# EAGLE design HumidityMetter (EAGLE 6.1)
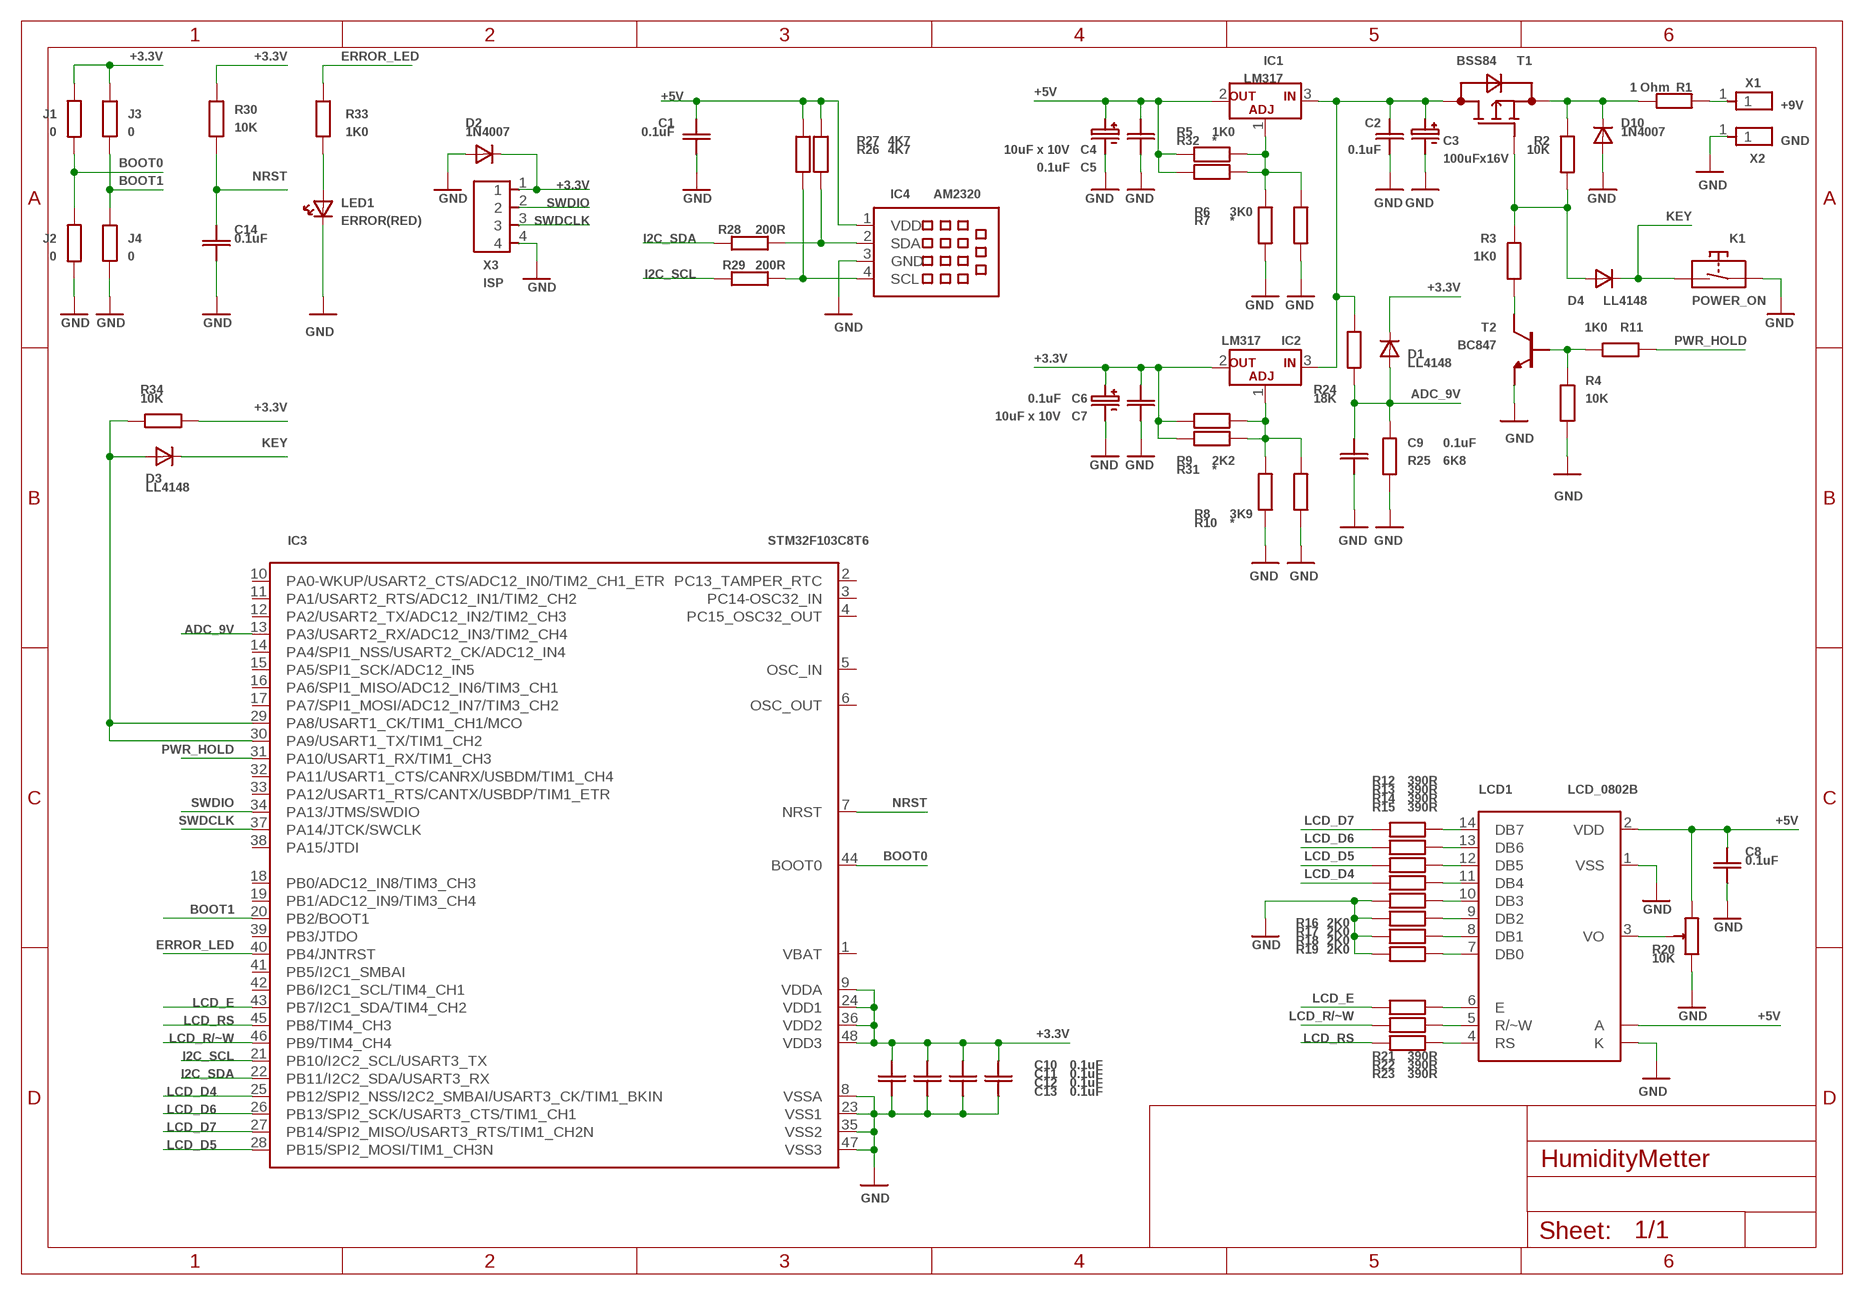
[diagram p0: schematic, sheet 1]

## Parts
C1  0.1uF  CSMD_0805  [RSMD_0805]
C2  0.1uF  CSMD_0805  [RSMD_0805]
C3  100uFx16V  CE6.3MM  [CE_6.3MM]
C4  10uF x 10V  CE5.2MM  [CE_5.2MM]
C5  0.1uF  CSMD_0805  [RSMD_0805]
C6  0.1uF  CSMD_0805  [RSMD_0805]
C7  10uF x 10V  CE5.2MM  [CE_5.2MM]
C8  0.1uF  CSMD_0805  [RSMD_0805]
C9  0.1uF  CSMD_0805  [RSMD_0805]
C10  0.1uF  CSMD_0805  [RSMD_0805]
C11  0.1uF  CSMD_0805  [RSMD_0805]
C12  0.1uF  CSMD_0805  [RSMD_0805]
C13  0.1uF  CSMD_0805  [RSMD_0805]
C14  0.1uF  CSMD_0805  [RSMD_0805]
D1  LL4148  LL4147SOD-80  [SOD-80]
D2  1N4007  1N4001DO-41_10MM  [DO-41_10MM]
D3  LL4148  LL4147SOD-80  [SOD-80]
D4  LL4148  LL4147SOD-80  [SOD-80]
D10  1N4007  1N4001DO-41_10MM  [DO-41_10MM]
IC1  LM317  LM317(D2PAK)  [D2PAK]
IC2  LM317  LM317(D2PAK)  [D2PAK]
IC3  STM32F103C8T6  STM32F103C8T6(LQFP48)(LQFP48)  [LQFP48]
IC4  AM2320  AM2320(HOR)  [AM2320_HOR]
J1  0  RSMD_0805  [RSMD_0805]
J2  0  RSMD_0805  [RSMD_0805]
J3  0  RSMD_0805  [RSMD_0805]
J4  0  RSMD_0805  [RSMD_0805]
K1  POWER_ON  KEY(7X4.5)  [KEY_7X4.5]
LCD1  LCD_0802B  LCD_0802B(0802B_CHINA_CLONE)  [LCD_0802B(CHINA_CLONE)]
LED1  ERROR(RED)  LED3MM(SMD0805)  [LED_0805]
R1  1 Ohm  R0207  [R0207]
R2  10K  RSMD_0805  [RSMD_0805]
R3  1K0  RSMD_0805  [RSMD_0805]
R4  10K  RSMD_0805  [RSMD_0805]
R5  1K0  RSMD_0805  [RSMD_0805]
R6  3K0  RSMD_0805  [RSMD_0805]
R7  *  RSMD_0805  [RSMD_0805]
R8  3K9  RSMD_0805  [RSMD_0805]
R9  2K2  RSMD_0805  [RSMD_0805]
R10  *  RSMD_0805  [RSMD_0805]
R11  1K0  RSMD_1206_BIG_GAP  [RSMD_1206_BIG_GAP]
R12  390R  RSMD_0805  [RSMD_0805]
R13  390R  RSMD_0805  [RSMD_0805]
R14  390R  RSMD_0805  [RSMD_0805]
R15  390R  RSMD_0805  [RSMD_0805]
R16  2K0  RSMD_0805  [RSMD_0805]
R17  2K0  RSMD_0805  [RSMD_0805]
R18  2K0  RSMD_0805  [RSMD_0805]
R19  2K0  RSMD_0805  [RSMD_0805]
R20  10K  R_ADJSTAND_6.5_X_3.5MM  [R_ADJ_STAND]
R21  390R  RSMD_0805  [RSMD_0805]
R22  390R  RSMD_0805  [RSMD_0805]
R23  390R  RSMD_0805  [RSMD_0805]
R24  18K  RSMD_1206_BIG_GAP  [RSMD_1206_BIG_GAP]
R25  6K8  RSMD_0805  [RSMD_0805]
R26  4K7  R0207  [R0207]
R27  4K7  R0207  [R0207]
R28  200R  R0207  [R0207]
R29  200R  R0207  [R0207]
R30  10K  RSMD_0805  [RSMD_0805]
R31  *  RSMD_0805  [RSMD_0805]
R32  *  RSMD_0805  [RSMD_0805]
R33  1K0  RSMD_0805  [RSMD_0805]
R34  10K  RSMD_0805  [RSMD_0805]
T1  BSS84  BSS84(SOT23)  [SOT23]
T2  BC847  BC847SOT23_SMALL_PADS  [SOT23_SMALL_PADS]
X1  +9V  PIN1X13.5MM_DRILL  [PIN1X1_D3.5MM]
X2  GND  PIN1X13.5MM_DRILL  [PIN1X1_D3.5MM]
X3  ISP  PIN4X1(2.54MM)  [PIN4X1_2.54MM]

## Nets
+3.3V: C6.PAD_1(PIN1) C7.PLUS C10.PAD_1(PIN1) C11.PAD_1(PIN1) C12.PAD_1(PIN1) C13.PAD_1(PIN1) D1.CATHODE D2.CATHODE IC2.2(OUT) IC3.9(VDDA) IC3.24(VDD1) IC3.36(VDD2) IC3.48(VDD3) J1.PAD_0(PIN0) J3.PAD_0(PIN0) R9.PAD_1(PIN1) R30.PAD_0(PIN0) R31.PAD_1(PIN1) R34.PAD_1(PIN1) X3.1
+5V: C1.PAD_1(PIN1) C4.PLUS C5.PAD_1(PIN1) C8.PAD_1(PIN1) IC1.2(OUT) IC4.1(VDD) LCD1.2(VDD) LCD1.A R5.PAD_1(PIN1) R20.3(END_B) R26.PAD_0(PIN0) R27.PAD_0(PIN0) R32.PAD_1(PIN1)
ADC_9V: C9.PAD_1(PIN1) D1.ANODE IC3.13(PA3/USART2_RX/ADC12_IN3/TIM2_CH4) R24.PAD_1(PIN1) R25.PAD_0(PIN0)
BOOT0: IC3.44(BOOT0) J1.PAD_1(PIN1) J2.PAD_0(PIN0)
BOOT1: IC3.20(PB2/BOOT1) J3.PAD_1(PIN1) J4.PAD_0(PIN0)
ERROR_LED: IC3.40(PB4/JNTRST) R33.PAD_0(PIN0)
GND: C1.PAD_0(PIN0) C2.PAD_0(PIN0) C3.MINUS C4.MINUS C5.PAD_0(PIN0) C6.PAD_0(PIN0) C7.MINUS C8.PAD_0(PIN0) C9.PAD_0(PIN0) C10.PAD_0(PIN0) C11.PAD_0(PIN0) C12.PAD_0(PIN0) C13.PAD_0(PIN0) C14.PAD_0(PIN0) D2.ANODE D10.ANODE IC3.8(VSSA) IC3.23(VSS1) IC3.35(VSS2) IC3.47(VSS3) IC4.3(GND) J2.PAD_1(PIN1) J4.PAD_1(PIN1) K1.1 K1.2 LCD1.1(VSS) LCD1.K LED1.CATHODE R4.PAD_1(PIN1) R6.PAD_1(PIN1) R7.PAD_1(PIN1) R8.PAD_1(PIN1) R10.PAD_1(PIN1) R16.PAD_1(PIN1) R17.PAD_1(PIN1) R18.PAD_1(PIN1) R19.PAD_1(PIN1) R20.1(END_A) R25.PAD_1(PIN1) T2.2(E) X2.1 X3.4
I2C_SCL: IC3.21(PB10/I2C2_SCL/USART3_TX) R29.PAD_0(PIN0)
I2C_SDA: IC3.22(PB11/I2C2_SDA/USART3_RX) R28.PAD_0(PIN0)
KEY: D3.CATHODE D4.CATHODE K1.3 K1.4
LCD_D4: IC3.25(PB12/SPI2_NSS/I2C2_SMBAI/USART3_CK/TIM1_BKIN) R15.PAD_1(PIN1)
LCD_D5: IC3.28(PB15/SPI2_MOSI/TIM1_CH3N) R14.PAD_1(PIN1)
LCD_D6: IC3.26(PB13/SPI2_SCK/USART3_CTS/TIM1_CH1) R13.PAD_1(PIN1)
LCD_D7: IC3.27(PB14/SPI2_MISO/USART3_RTS/TIM1_CH2N) R12.PAD_1(PIN1)
LCD_E: IC3.43(PB7/I2C1_SDA/TIM4_CH2) R21.PAD_1(PIN1)
LCD_R/~W: IC3.46(PB9/TIM4_CH4) R22.PAD_1(PIN1)
LCD_RS: IC3.45(PB8/TIM4_CH3) R23.PAD_1(PIN1)
N$1: R1.PAD1(PIN1) X1.1
N$2: D10.CATHODE R1.PAD_0(PIN0) R2.PAD_0(PIN0) T1.2(SOURCE)
N$3: D4.ANODE R2.PAD_1(PIN1) R3.PAD_0(PIN0) T1.1(GATE)
N$4: R3.PAD_1(PIN1) T2.3(C)
N$5: R4.PAD_0(PIN0) R11.PAD_1(PIN1) T2.1(B)
N$6: C2.PAD_1(PIN1) C3.PLUS IC1.3(IN) IC2.3(IN) R24.PAD_0(PIN0) T1.3(DRAIN)
N$7: IC1.1(ADJ) R5.PAD_0(PIN0) R6.PAD_0(PIN0) R7.PAD_0(PIN0) R32.PAD_0(PIN0)
N$8: IC2.1(ADJ) R8.PAD_0(PIN0) R9.PAD_0(PIN0) R10.PAD_0(PIN0) R31.PAD_0(PIN0)
N$9: LCD1.3(VO) R20.2(ADJ)
N$10: LCD1.14(DB7) R12.PAD_0(PIN0)
N$11: LCD1.13(DB6) R13.PAD_0(PIN0)
N$12: LCD1.12(DB5) R14.PAD_0(PIN0)
N$13: LCD1.11(DB4) R15.PAD_0(PIN0)
N$14: IC4.2(SDA) R26.PAD1(PIN1) R28.PAD1(PIN1)
N$15: LCD1.10(DB3) R16.PAD_0(PIN0)
N$16: LCD1.9(DB2) R17.PAD_0(PIN0)
N$17: LCD1.8(DB1) R18.PAD_0(PIN0)
N$18: LCD1.7(DB0) R19.PAD_0(PIN0)
N$19: LED1.ANODE R33.PAD_1(PIN1)
N$20: IC4.4(SCL) R27.PAD1(PIN1) R29.PAD1(PIN1)
N$21: LCD1.4(RS) R23.PAD_0(PIN0)
N$22: LCD1.5(R/~W) R22.PAD_0(PIN0)
N$23: LCD1.6(E) R21.PAD_0(PIN0)
N$24: D3.ANODE IC3.29(PA8/USART1_CK/TIM1_CH1/MCO) IC3.30(PA9/USART1_TX/TIM1_CH2) R34.PAD_0(PIN0)
NRST: C14.PAD_1(PIN1) IC3.7(NRST) R30.PAD_1(PIN1)
PWR_HOLD: IC3.31(PA10/USART1_RX/TIM1_CH3) R11.PAD_0(PIN0)
SWDCLK: IC3.37(PA14/JTCK/SWCLK) X3.3
SWDIO: IC3.34(PA13/JTMS/SWDIO) X3.2
Unconnected: IC3.1(VBAT) IC3.2(PC13_TAMPER_RTC) IC3.3(PC14-OSC32_IN) IC3.4(PC15_OSC32_OUT) IC3.5(OSC_IN) IC3.6(OSC_OUT) IC3.10(PA0-WKUP/USART2_CTS/ADC12_IN0/TIM2_CH1_ETR) IC3.11(PA1/USART2_RTS/ADC12_IN1/TIM2_CH2) IC3.12(PA2/USART2_TX/ADC12_IN2/TIM2_CH3) IC3.14(PA4/SPI1_NSS/USART2_CK/ADC12_IN4) IC3.15(PA5/SPI1_SCK/ADC12_IN5) IC3.16(PA6/SPI1_MISO/ADC12_IN6/TIM3_CH1) IC3.17(PA7/SPI1_MOSI/ADC12_IN7/TIM3_CH2) IC3.18(PB0/ADC12_IN8/TIM3_CH3) IC3.19(PB1/ADC12_IN9/TIM3_CH4) IC3.32(PA11/USART1_CTS/CANRX/USBDM/TIM1_CH4) IC3.33(PA12/USART1_RTS/CANTX/USBDP/TIM1_ETR) IC3.38(PA15/JTDI) IC3.39(PB3/JTDO) IC3.41(PB5/I2C1_SMBAI) IC3.42(PB6/I2C1_SCL/TIM4_CH1)

## Library data of the parts
C1 C2 C5 C6 C8-C14 = __MyCommonLib1:C
C3 C4 C7 = __MyCommonLib1:CE
D1 D3 D4 = __MyCommonLib1:LL4147
D2 D10 = __MyCommonLib1:1N4001
IC1 IC2 = __MyCommonLib1:LM317
IC3 = __MyCommonLib1:STM32F103C8T6(LQFP48)
IC4 = __MyCommonLib1:AM2320
J1-J4 R1-R19 R21-R34 = __MyCommonLib1:R
K1 = __MyCommonLib1:KEY
LCD1 = __MyCommonLib1:LCD_0802B
LED1 = __MyCommonLib1:LED3MM
R20 = __MyCommonLib1:R_ADJ
T1 = __MyCommonLib1:BSS84
T2 = __MyCommonLib1:BC847
X1 X2 = __MyCommonLib1:PIN1X1
X3 = __MyCommonLib1:PIN4X1

## Board
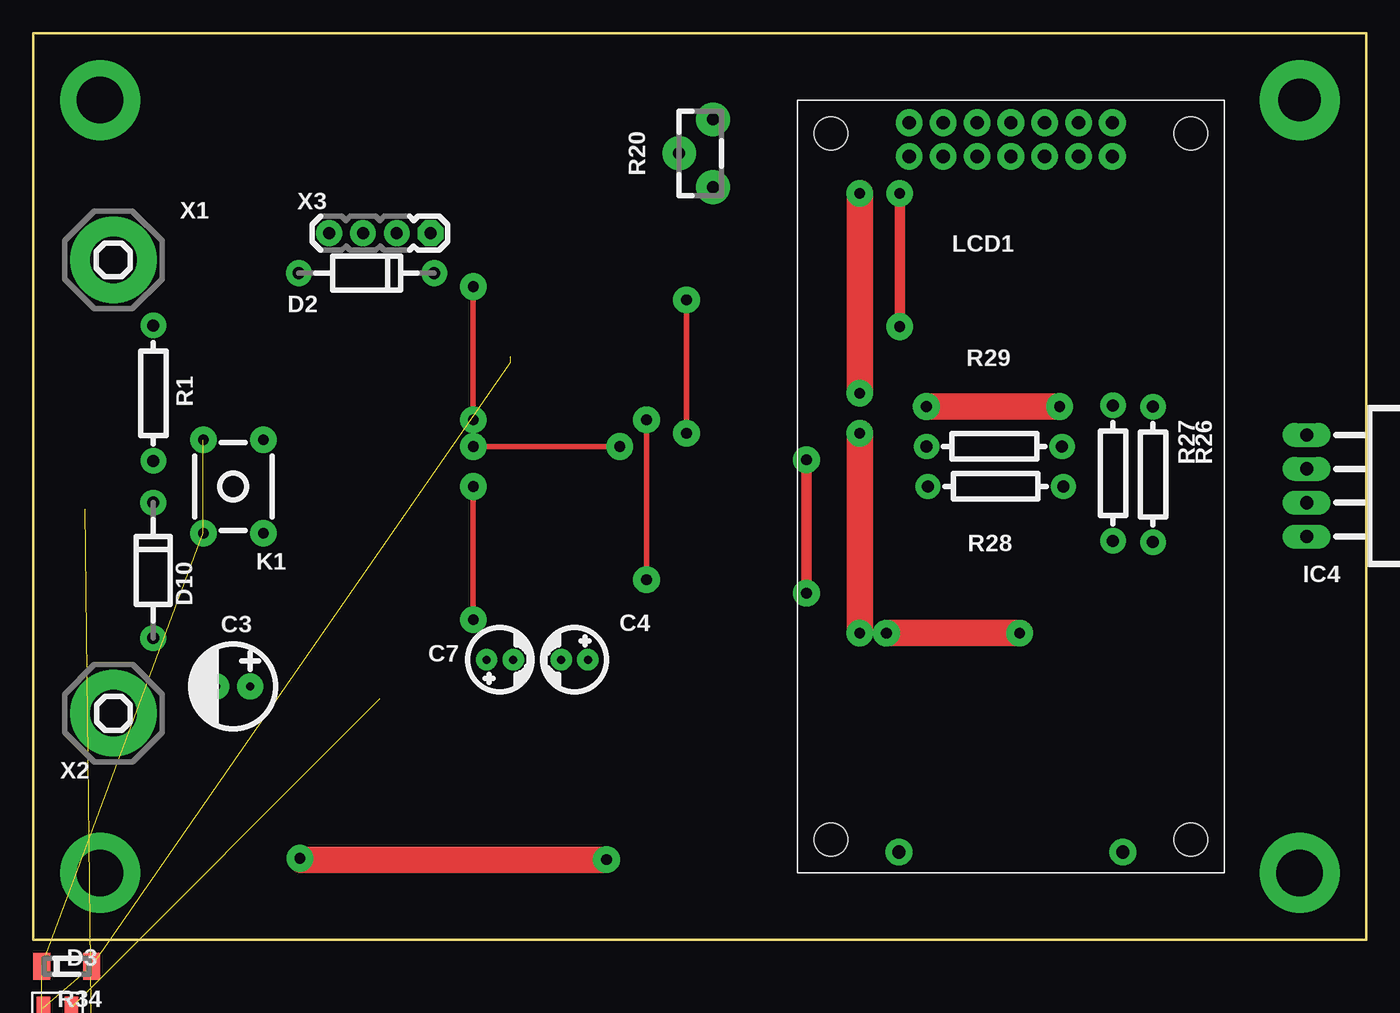
[diagram p1: board, top side]
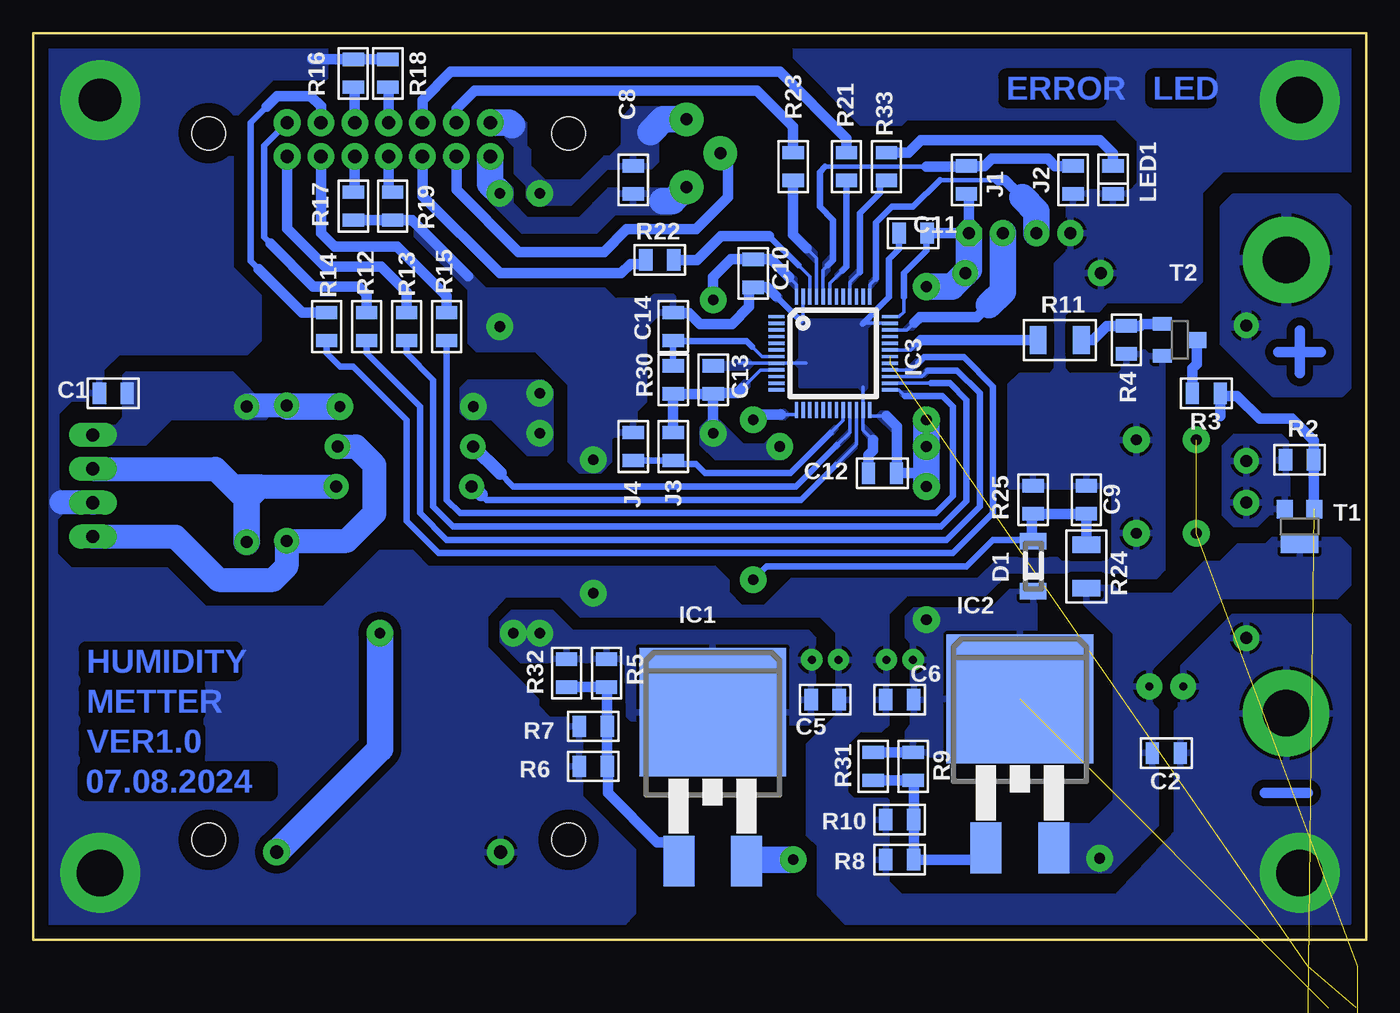
[diagram p2: board, bottom side, seen from below]

Size 100 x 68 mm. Coordinates in mm from the lower left corner, seen from the top.
Outline: 0,0 100,0 100,68 0,68 0,0
Copper layers (1*16): Top 0.035mm / dielectric 1.5mm / Bottom 0.035mm
Design rules: minimum track width 0.25mm, minimum drill 0.6mm, track to track 0.25mm, track to pad 0.25mm, pad to pad 0.25mm, via to via 0.25mm, smd to smd 0mil, copper to edge 1mm, drill to drill 0.5mm, minimum pad ring 10mil, minimum via ring 8mil, stop-mask expansion 4mil, vias tented up to drill 0mil, thermal gap 10mil

### Footprints (pad centres in the part's own frame; a part is rotated, then mirrored left to right if it is on the bottom)
RSMD_0805 = smd 1 x 1.6: PAD_0 -1.05,0; PAD_1 1.05,0
CE_6.3MM = drill 0.6 pad 1.93: MINUS -1.27,0; PLUS 1.27,0
CE_5.2MM = drill 0.6 pad 1.6: MINUS -1,0; PLUS 1,0
SOD-80 = smd 1.25 x 2: ANODE 1.875,0; CATHODE -1.875,0
DO-41_10MM = drill 0.9 pad 1.93: ANODE -5.08,0; CATHODE 5.08,0
D2PAK = smd 2.32 x 3.81: 1 -2.54,-11.17; 3 2.54,-11.17 | smd 11 x 9.65: 2 0,0
LQFP48 = smd 0.25 x 1.2: 1 -2.75,-4.25; 2 -2.25,-4.25; 3 -1.75,-4.25; 4 -1.25,-4.25; 5 -0.75,-4.25; 6 -0.25,-4.25; 7 0.25,-4.25; 8 0.75,-4.25; 9 1.25,-4.25; 10 1.75,-4.25; 11 2.25,-4.25; 12 2.75,-4.25; 25 2.75,4.25; 26 2.25,4.25; 27 1.75,4.25; 28 1.25,4.25; 29 0.75,4.25; 30 0.25,4.25; 31 -0.25,4.25; 32 -0.75,4.25; 33 -1.25,4.25; 34 -1.75,4.25; 35 -2.25,4.25; 36 -2.75,4.25 | smd 1.2 x 0.25: 13 4.25,-2.75; 14 4.25,-2.25; 15 4.25,-1.75; 16 4.25,-1.25; 17 4.25,-0.75; 18 4.25,-0.25; 19 4.25,0.25; 20 4.25,0.75; 21 4.25,1.25; 22 4.25,1.75; 23 4.25,2.25; 24 4.25,2.75; 37 -4.25,2.75; 38 -4.25,2.25; 39 -4.25,1.75; 40 -4.25,1.25; 41 -4.25,0.75; 42 -4.25,0.25; 43 -4.25,-0.25; 44 -4.25,-0.75; 45 -4.25,-1.25; 46 -4.25,-1.75; 47 -4.25,-2.25; 48 -4.25,-2.75
AM2320_HOR = drill 1 pad 1.8 long: 1 -4.5,3.81; 2 -4.5,1.27; 3 -4.5,-1.27; 4 -4.5,-3.81
KEY_7X4.5 = drill 0.8 pad 2: 1 -3.5,-2.25; 2 3.5,-2.25; 3 3.5,2.25; 4 -3.5,2.25
LCD_0802B(CHINA_CLONE) = drill 1 pad 2: 1 4.24,8.38; 2 1.7,8.38; 3 4.24,10.92; 4 1.7,10.92; 5 4.24,13.46; 6 1.7,13.46; 7 4.24,16; 8 1.7,16; 9 4.24,18.54; 10 1.7,18.54; 11 4.24,21.08; 12 1.7,21.08; 13 4.24,23.62; 14 1.7,23.62; A 56.44,24.4; K 56.44,7.6 | hole 2.5: 2.5,2.5; 2.5,29.5; 55.5,29.5; 55.5,2.5
LED_0805 = smd 1 x 1.6: ANODE -1.05,0; CATHODE 1.05,0
R0207 = drill 0.9 pad 1.9: PAD1 5.08,0; PAD_0 -5.08,0
RSMD_1206_BIG_GAP = smd 1.25 x 2.1: PAD_0 -1.625,0; PAD_1 1.625,0
R_ADJ_STAND = drill 0.9 pad 2.54: 1 -2.54,0; 2 0,2.54; 3 2.54,0
SOT23 = smd 1.2 x 1.4: 1 1.1,1.3; 2 -1.1,1.3 | smd 2.8 x 1.4: 3 0,-1.3
SOT23_SMALL_PADS = smd 1 x 1.4: 1 1.2,1.3; 2 -1.2,1.3 | smd 1.2 x 1.4: 3 0,-1.3
PIN1X1_D3.5MM = drill 3.5 pad 6.5: 1 0,0
PIN4X1_2.54MM = drill 0.9 pad 1.93 octagon: 1 -3.81,0 | drill 0.9 pad 1.93: 2 -1.27,0; 3 1.27,0; 4 3.81,0

### Placement (x,y rotation side)
C1  94,41 0 bottom
C2  15,14 180 bottom
C3  15,19 0 top
C4  40.6,21 0 top
C5  40.6,18 180 bottom
C6  35,18 0 bottom
C7  35,21 180 top
C8  55,57 90 bottom
C9  21,33 270 bottom
C10  46,50 90 bottom
C11  34,53 0 bottom
C12  36.3,35 0 bottom
C13  49,42 270 bottom
C14  52,46 270 bottom
D1  24.98,28.02 90 bottom
D2  25,50 0 top
D3  2.5,-2 0 top
D4  2.5,-8.2 0 top  (outside the outline)
D10  9,27.7 90 top
IC1  49.03,17.06 0 bottom
IC2  25.98,18.06 0 bottom
IC3  40,44 270 bottom
IC4  100.04,34.05 0 top
J1  30,57 90 bottom
J2  22,57 270 bottom
J3  52,37 270 bottom
J4  55,37 90 bottom
K1  15,34 90 top
LCD1  57.34,63 270 top
LED1  19,57 270 bottom
R1  9,41 90 top
R2  5,36 0 bottom
R3  12,41 180 bottom
R4  18,45 270 bottom
R5  57,20 90 bottom
R6  58,13 180 bottom
R7  58,16 180 bottom
R8  35,6 180 bottom
R9  34,13 90 bottom
R10  35,9 180 bottom
R11  23,45 0 bottom
R12  75,46 270 bottom
R13  72,46 270 bottom
R14  78,46 270 bottom
R15  69,46 270 bottom
R16  76,65 90 bottom
R17  75.99,55.03 270 bottom
R18  73.4,65 90 bottom
R19  73.05,55.03 270 bottom
R20  51,59 90 top
R21  39,58 270 bottom
R22  53,51 0 bottom
R23  43,58 270 bottom
R24  21,28 90 bottom
R25  25,33 90 bottom
R26  84,34.9 270 top
R27  81,35 270 top
R28  72.2,34 0 top
R29  72.1,37 0 top
R30  52,42 90 bottom
R31  37,13 90 bottom
R32  60,20 90 bottom
R33  36,58 90 bottom
R34  1.8,-5.1 0 top  (outside the outline)
T1  5,31 0 bottom
T2  14,45 90 bottom
X1  6,51 0 top
X2  6.01,16.98 0 top
X3  26,53 180 top

### Tracks (layer width: path | path; a pad name or v marks a point on that pad's centre or on a via)
+3.3V  (via drill 0.8 pad 2)  (1 unrouted)
  Top 0.4: v33,37 v44,37 | v33,24 v33,34 | v33,39 v33,49
  Top 0.406: v49,48 v49,38
  Bottom 0.25: IC3.24 37.25,39.3 36,39.3 | IC3.9 45.45,42.75 46.8,41.4 | IC3.48 42.75,49.15 43.3,49.7 | IC3.36 35.05,46.75 34.7,47.1 34.7,48.2
  Bottom 0.4: 25.86,18.19 IC2.2
  Bottom 0.406: 48.95,41 C13.PAD_1
  Bottom 0.5: 34.7,48.2 34.7,50 33,51.7 33,52.95 C11.PAD_1
  Bottom 0.8: 36,39.3 35.2,38.5 35.2,35.05 C12.PAD_1 33.5,35 33,34.5 | 46.8,41.4 47.2,41 48.95,41 | v49,38 C13.PAD_1 R30.PAD_0 J3.PAD_0 | v49,48 49,49.7 47.65,51.05 C10.PAD_1 44.65,51.05 43.3,49.7 | C11.PAD_1 32.85,53.1 32.75,53 X3.1 29.81,55.76 J1.PAD_0 | R31.PAD_1 R9.PAD_1
  Bottom 2: v33,39 v33,37 33,34.5 v33,34 | X3.1 29.81,50.27 D2.CATHODE 31.08,49 v33,49
  pour Bottom: 43.3,37.2 43.3,36.7 43.8,36.2 48.8,36.2 49.8,37.2 49.8,38.4 49.4,38.8 48.6,38.8 46.8,37 45.1,37 44.4,37.7 43.8,37.7
  pour Bottom: 21.1,13.9 34.4,13.9 34.4,15.6 34,16.1 34,22.3 34.4,22.7 34.4,24.2 33.9,24.7 28.1,24.7 26.7,26.1 24.9,26.1 24.9,22.1 21.1,22.1
  pour Bottom (no thermals): 42.8,49.1 42.8,49.6 43.2,50 43.6,49.6 42.8,48.8
  pour Bottom: 35.7,39.4 35.9,39.6 36.4,39.6 36.7,39.3 35.4,38 35.4,39.1 35.6,39.3
  pour Bottom: 46.7,41.1 46.3,41.5 46.3,41.9 46.7,41.9 47.1,41.5
+5V  (via drill 0.8 pad 2)
  Top 2: v62,23 v62,38 | v62,56 v62,41 | v67,40 v77,40 | v64,23 v74,23
  Bottom 1.8: R26.PAD_0 arc90 83.9,40.08 R27.PAD_0 arc90 80.92,40
  Bottom 2: LCD1.2 64.3,61.3 64.1,61.1 | R20.3 52.76,61.54 53.7,60.6 | 80.92,40 v77,40 | LCD1.A 74,14.3 v74,23
  pour Bottom: 52.9,62.3 52.9,60.3 53.3,59.9 53.3,58.4 53.7,58 57,58 58.2,56.8 59.7,55.3 62.4,55.3 62.8,55.7 62.8,56.6 63.7,57.5 63.7,58.4 63.7,59.5 64.7,60.5 64.7,61.8 63.8,61.8 63.2,61.2 63.2,59.5 62.9,59.2 62.9,58 61.8,56.9 61.7,56.8 59.5,56.8 58.9,56.8 57.1,58.6 56.7,58.6 55.7,59.6 55.7,60.8 55.7,61.6 55,62.3
  pour Bottom: 41.9,23 41.5,22.6 41.5,16.7 41.9,16.3 54.8,16.3 55.3,16.8 55.4,20.6 55.8,21 63.4,21 64.8,22.4 64.8,23.8 64.1,24.5 61.1,24.5 59.6,23
  pour Bottom (no thermals): 61.8,41.8 61.2,41.2 61.2,36.8 61.5,36.5 62.9,36.5 65.6,39.2 67.4,39.2 67.8,39.6 67.8,41.3 67.3,41.8
  pour Bottom (no thermals): 82.6,39.2 89.7,39.2 91.6,37.3 96.2,37.3 96.3,37.4 96.3,38.3 96.2,38.4 93.8,38.4 93.1,39.1 93.1,42.3 93,42.4 85.1,42.4 82.6,39.9
ADC_9V  (via drill 0.8 pad 2)
  Top 0.4: v46,39 v46,27
  Bottom 0.25: IC3.13 42.75,39.4 43.9,39.4
  Bottom 0.5: v46,27 45,28 30,28 28,30 25.09,30 D1.ANODE
  Bottom 0.8: 43.9,39.4 45.6,39.4 v46,39 | R24.PAD_1 C9.PAD_1 R25.PAD_0 25.09,31.86 25.09,30
  pour Bottom: 43.3,39.4 43.6,39.1 44,39.1 44,39.7 43.6,39.7
BOOT0
  Bottom 0.25: IC3.44 40.75,50.25 40.4,50.6
  Bottom 0.35: 40.6,58 33,58
  Bottom 0.5: 40.6,58 41,57.6 41,55 40,54 40,51 40.4,50.6
  Bottom 0.8: J2.PAD_0 23.35,58.05 23.9,58.6 28.1,58.6 28.65,58.05 J1.PAD_1 arc90 30.05,58 33,58
  pour Bottom: 40,50.9 40,50.8 40.3,50.5 40.3,50.2 40.7,49.8 40.7,50.8 40,51.5
BOOT1
  Bottom 0.25: IC3.20 39.25,38.95 40.2,38
  Bottom 0.4: 51.95,36 J3.PAD_1
  Bottom 0.5: 40.2,38 43.2,35 49.6,35 50.3,35.7 51.75,35.7 J3.PAD_1 J4.PAD_0
  pour Bottom: 40.1,37.9 39.7,38.3 39.7,38.5 39.9,38.5 40.3,38.1
ERROR_LED
  Bottom 0.25: IC3.40 38.75,49.35 38,50.1
  Bottom 0.5: 38,50.1 38,54.5 36.5,56 36.5,56.45 arc90 R33.PAD_0
  pour Bottom: 37.9,50.2 37.9,50 38.7,49.2 38.7,49.7 37.9,50.5
GND  (via drill 0.8 pad 2, 3.2 pad 6, 3.5 pad 6)
  Top 0.8: v65,56 v65,46 | v58,36 v58,26
  Bottom 0.25: IC3.35 37.65,46.25 | 37.75,41.45 IC3.23 37.75,38.25 37,37.5 | IC3.47 42.25,46.55 | 42.05,43.25 IC3.8 47.05,43.25
  Bottom 0.4: 44.3,48.3 42.4,46.4 | 35.8,48.2 37.8,46.2
  Bottom 0.5: 35.8,48.2 35.8,51.05 35.05,51.8 C11.PAD_0
  Bottom 0.8: C12.PAD_0 37.35,36.35 37,36.7 37,37.5 | C14.PAD_0 51.95,47 50.8,47 50,46.2 47.6,46.2 46.3,47.5 46.3,48.65 C10.PAD_0 44.95,48.95 44.3,48.3 | 22.19,55.95 J2.PAD_1 | R17.PAD_1 R19.PAD_1 71.58,53.98 67.4,49.8 | 79.1,66.1 79.05,66.05 R16.PAD_1 R18.PAD_1
  Bottom 1.8: IC4.3 95.56,32.8 97.9,32.8
  Bottom 2: R20.1 52.06,55.4 52.8,55.4 | LCD1.1 65.72,56.72 v65,56
  other vias: 95,5 95,63 5,5 5,63
  pour Bottom: 37.5,46.5 37.2,46.8 37.2,46.2 37.5,45.9 37.5,41.4 37.7,41.2 37.8,41.2 38.1,41.5 42.5,41.5 42.5,42.9 42.8,43.2 42.8,43.3 42.5,43.6 42.5,46.4 42.7,46.6 42.7,46.8 42.2,46.8 41.9,46.5
  pour Bottom: 56.8,56.2 52.2,56.2 52.2,54.6 56.4,54.6 57.8,53.2 63.3,53.2 65.8,55.7 65.8,56.4 65.4,56.8 64.7,56.8 64.2,56.3 64.2,55.2 63,54 59,54
  pour Bottom: 54.9,37.9 56.5,37.9 56.8,37.6 56.8,35.9 57.5,35.2 59,35.2 59.7,35.9 59.7,41.7 62.3,44.3 65.6,44.3 66.7,44.3 67.2,44.8 67.2,48.8 71.2,52.8 71.2,53.8 66.1,48.7 57.2,48.7 56.4,47.9 53.7,47.9 53.4,48.2 52,48.2 52,46.9 53.3,46.9 54.2,46 54.2,40.4 54.9,39.7
  pour Bottom (isolate 0.6): 2,24.2 10,24.2 13.9,20.3 13.9,17.4 14.2,17.1 14.2,8 18.7,3.2 34.9,3.2 36,4.3 36,10.4 38.5,10.4 39.1,11 39.1,14.7 38,15.8 36.4,15.8 36,16.2 36,26.6 36.3,26.9 43.1,26.9 45.1,24.9 46.9,24.9 48,26 48,26.9 48.9,27.8 70.4,27.8 71.6,29 74,29 78.2,24.8 87.1,24.8 90,27.7 97.2,27.7 98.4,28.9 98.4,31.6 97.8,32.2 97.8,33.3 98.3,33.8 98.3,39.5 97.2,40.6 94.9,40.6 94.9,42.8 93.6,44.1 84,44.1 83.1,45 83.1,48.3 85.2,50.4 85.2,61.6 82.1,64.7 78.1,64.7 78.1,66.8 98.8,66.8 98.8,1.2 89.9,1.3 64,1.2 55.8,1.2 55,2 55,6.7 59,10.7 59,16.5 61.3,16.5 62.3,17.5 62.3,18 66.1,21.9 66.1,24.3 64.6,25.9 60.4,25.9 58.9,24.4 40.9,24.4 39.6,23.1 39.6,16.8 41.8,14.6 41.8,7.9 41,7.1 41,3.4 39,1.3 1.3,1.3 1.3,23.5
  pour Bottom (isolate 0.6): 15.3,43.8 15.3,27.8 15.8,27.3 17.8,27.3 18.2,27.7 26.9,27.7 28.6,26 34.5,26 36,24.5 36,24.2 36.3,24.2 36.3,26.9 29.1,26.9 27.5,28.5 23.2,28.5 22.9,28.2 19.4,28.2 18.9,28.7 18.9,33.4 19.5,34 26.7,34 26.7,41.6 26,42.3 23.7,42.3 23.2,42.8 23.2,50.7 22.3,51.6 22.3,56.1 17.6,56.1 17,56.7 17,60 18.7,61.7 34.5,61.7 34.9,61.3 37.9,61.3 42.8,66.2 42.8,66.8 1.2,66.8 1.2,57.8 10.8,57.8 12.5,56.1 12.5,49.4 13.9,48 19.5,48 20.1,47.3 22.4,47.3 22.8,46.9 22.8,42.8 22.3,42.3 18.6,42.3 18.2,42.7 18.2,44.2 16.8,44.2 16.4,43.8
  pour Bottom: 36.7,37.5 36.7,37.6 37.7,38.6 37.7,38 37.2,37.5
  pour Bottom (no thermals): 49.1,42.8 46.4,42.8 46,43.2 46.3,43.5 47.2,43.5 47.4,43.3 49.1,43.3
  pour Bottom: 43.9,47.9 44.2,47.9 44.3,47.9 44.6,48.2 44.2,48.6 43.9,48.3
I2C_SCL
  Bottom 0.25: IC3.21 38.75,38.05 39.7,37.1
  Bottom 0.5: 39.7,37.1 42.8,34 64,34 65,35
  Bottom 1: R29.PAD_0 67,37 65,35
  pour Bottom: 39.7,36.9 38.8,37.8 38.8,38.2 39.9,37.1
I2C_SDA
  Bottom 0.25: IC3.22 38.25,37.15 39.8,35.6
  Bottom 0.5: 39.8,35.6 42.4,33 66,33 66.4,33.4
  Bottom 1: 66.4,33.4 67,34 R28.PAD_0
  pour Bottom: 39.7,35.5 38.3,36.9 38.3,37.3 39.9,35.7
KEY  (3 unrouted)
LCD_D4
  Bottom 0.25: IC3.25 35.05,41.25 34.6,40.8
  Bottom 0.5: 34.6,40.8 31.8,40.8 31,40 31,33.3 32.3,32 68,32 69,33 R15.PAD_1
  pour Bottom (no thermals): 34.4,40.7 34.7,40.7 34.9,40.9 34.9,41.1 34.2,41.1 33.8,40.7
LCD_D5
  Bottom 0.25: IC3.28 34.15,42.75 33.6,43.3
  Bottom 0.5: 33.6,43.3 33.2,43.7 30.2,43.7 28,41.5 28,32 31,29 69.6,29 72,31.4 72,39 76,43 77,43 78,44 R14.PAD_1
  pour Bottom: 33.5,43.2 33.9,42.8 34.5,42.8 33.8,43.5 33.2,43.5
LCD_D6
  Bottom 0.25: IC3.26 32.65,41.75
  Bottom 0.5: 32.65,41.75 31.25,41.75 30,40.5 30,32.9 31.9,31 68.5,31 70,32.5 70,42 72,44 R13.PAD_1
LCD_D7
  Bottom 0.25: IC3.27 33.35,42.25 32.9,42.7
  Bottom 0.5: 32.9,42.7 30.7,42.7 29,41 29,32.5 31.5,30 69,30 71,32 71,40 75,44 R12.PAD_1
  pour Bottom: 32.7,42.8 33,42.8 33.5,42.3 33.1,42.3 32.6,42.8
LCD_E
  Bottom 0.25: IC3.43 40.25,49.25 39.3,50.2
  Bottom 0.5: 39.3,50.2 39,50.5 R21.PAD_1
  pour Bottom: 39.2,50.2 39.8,49.6 39.8,49.9 39.2,50.5
LCD_R/~W
  Bottom 0.25: IC3.46 41.75,49.75 42.6,50.6
  Bottom 0.5: 42.6,50.6 44.8,52.8
  Bottom 0.8: R22.PAD_1 50.2,51 48.4,52.8 44.8,52.8
LCD_RS
  Bottom 0.25: IC3.45 41.25,51.15 42,51.9
  Bottom 0.8: R23.PAD_1 43,52.9 42,51.9
  pour Bottom: 41.3,50.9 41.3,51.6 41.8,52.1 42.2,51.7 41.3,50.8
N$1
  pour Bottom (isolate 0.6): 2.2,55.6 1.4,54.8 1.4,41.6 1.9,41.1 6.9,41.1 10.6,44.8 10.6,54.9 9.9,55.6
N$2
  pour Bottom: 6,37.3 5.9,32.1 7.3,32.1 8.2,31.2 9.9,31.2 10.6,31.9 10.6,37 9.9,37.7 6.4,37.7
N$3  (1 unrouted)
  Bottom 0.8: T1.1 3.95,32.35 R2.PAD_1 3.95,37.45 5.6,39.1 8,39.1 9.7,40.8 10.75,40.8 R3.PAD_0 10.95,39.3
N$4
  Bottom 0.8: T2.3 12.7,43.2 13.05,42.85 R3.PAD_1
N$5
  Bottom 0.8: T2.1 16.8,46.2 16.95,46.05 R4.PAD_0 19.45,46.05 20.5,45 R11.PAD_1
N$6  (via drill 0.8 pad 2)
  Top 2: v43,6 20.1,6 v20,6.1
  Bottom 0.4: 46.38,6 IC1.3
  Bottom 2: 46.38,6 v43,6
  pour Bottom: 2,30 1.3,29.3 1.3,26.7 2.2,25.8 10.8,25.8 16.2,20.4 16.2,17.6 15.8,17.2 15.8,8.6 19.2,5.2 20.8,5.2 20.8,8.4 18.8,10.4 18.8,23 21.1,25.3 21.1,26.4 19,26.4 18.4,25.8 14.5,25.8 12.1,28.2 10.9,28.2 9.6,29.5 7.5,29.5 7,30
  pour Bottom (no thermals): 19.2,8.5 24.3,8.5 24.3,5.2 19.2,5.2
N$7
  Bottom 0.8: IC1.1 51.57,7.3 53.2,7.3 56.9,11 56.9,12.95 R6.PAD_0 R7.PAD_0 56.95,18.9 R5.PAD_0 R32.PAD_0
N$8
  Bottom 0.4: IC2.1 28.52,8 | 33.95,11.95 R9.PAD_0
  Bottom 0.8: R31.PAD_0 34.05,11.95 34,11.9 R9.PAD_0 33.95,11.9 R10.PAD_0 R8.PAD_0 28.52,6 IC2.1
N$9
  Bottom 0.8: R20.2 47.9,58.44 47.9,55.7 50.3,53.3 55.5,53.3 57.2,51.6 63.6,51.6 68.26,56.26 LCD1.3
N$10
  Bottom 0.5: LCD1.14 82.7,59.56 82.7,52.7 82.2,52.2
  Bottom 0.8: R12.PAD_0 75,48.4 75.6,49 79,49 82.2,52.2
N$11
  Bottom 0.8: LCD1.13 80.96,53.36 78.1,50.5 73.9,50.5 72,48.6 R13.PAD_0
N$12
  Bottom 0.5: 82.5,62.5 83.7,61.3 83.7,50.9 83.1,50.3
  Bottom 0.8: R14.PAD_0 79.85,47.05 83.1,50.3 | LCD1.12 78.42,62.52 79.2,63.3 81.7,63.3 82.5,62.5
N$13
  Bottom 0.8: LCD1.11 78.42,53.02 77.4,52 72.7,52 69,48.3 R15.PAD_0
N$14
  Bottom 1.8: 83,34 84,33 85,34 | 83,34 85,34 | IC4.2 86.32,35.32 85,34 | 83,34 R28.PAD1
  Bottom 2: R26.PAD1 84,33
N$15
  Bottom 0.8: LCD1.10 75.88,63.83 R16.PAD_0
N$16
  Bottom 0.8: LCD1.9 75.88,56.19 R17.PAD_0
N$17
  Bottom 0.8: LCD1.8 73.34,63.89 R18.PAD_0
N$18
  Bottom 0.8: LCD1.7 73.34,56.37 R19.PAD_0
N$19
  Bottom 0.8: LED1.ANODE 19,59 20,60 33.4,60 34.35,59.05 R33.PAD_1
N$20
  Bottom 1.8: IC4.4 89.34,30.24 86.1,27 82,27 81,28 R27.PAD1 76.48,29.92 74.4,32 74.4,35.6 75.8,37 R29.PAD1
N$21
  Bottom 0.8: R23.PAD_0 43,61 45.7,63.7 66.9,63.7 68.26,62.34 LCD1.4
N$22
  Bottom 0.8: LCD1.5 70.8,55.8 65,50 55.9,50 55.2,50.7 54.35,50.7 R22.PAD_0
N$23
  Bottom 0.8: R21.PAD_0 39,60.1 44,65.1 68.7,65.1 70.8,63 LCD1.6
N$24  (3 unrouted)
N$28
  Bottom 0.8: 3.4,44.1 5,44.1 | 5,44.1 5,45.7 | 5,42.5 5,44.1 | 6.6,44.1 5,44.1
N$30
  Bottom 0.8: 4.4,11 7.6,11
NRST
  Bottom 0.25: IC3.7 45.35,43.75 46.1,44.5
  Bottom 0.406: 51.95,45 C14.PAD_1
  Bottom 0.5: 46.1,44.5 46.5,44.9 51.95,44.9 | C14.PAD_1 51.95,44.9 | 51.95,44.9 52,44.85 R30.PAD_1
PWR_HOLD
  Bottom 0.25: IC3.31 34.15,44.25 33.6,44.8
  Bottom 0.8: 33.6,44.8 33.4,45 R11.PAD_0
  pour Bottom: 33.4,44.6 33.7,44.3 34.5,44.3 34,44.8 33.2,44.8
SWDCLK
  Bottom 0.25: IC3.37 37.25,49.15 36.8,49.6
  Bottom 0.35: 32,57 27.6,57
  Bottom 0.5: 36.8,49.6 36.8,53.8 35.6,55 34,55 32,57
  Bottom 0.8: 25.8,55.7 27.1,57 27.6,57
  Bottom 2: X3.3 24.73,54.63 25.8,55.7
  pour Bottom (no thermals): 36.7,49.6 36.7,49.4 37.2,48.9 37.2,49.4 36.7,49.9
SWDIO
  Bottom 0.25: IC3.34 34.45,45.75 33.9,46.3
  Bottom 0.8: 33.9,46.3 33.5,46.7 29.2,46.7 28.3,47.6
  Bottom 2: X3.2 27.27,48.63 28.3,47.6
  pour Bottom: 33.7,46.1 34,45.8 34.7,45.8 34,46.5 33.3,46.5

### Text on the board
Bottom: LED | ERROR | HUMIDITY | METTER | VER1.0 | 07.08.2024